# Altium schematic sheet Sheet1.SchDoc
size 317 x 241 mm; SheetNumber: 1; SheetTotal: 1
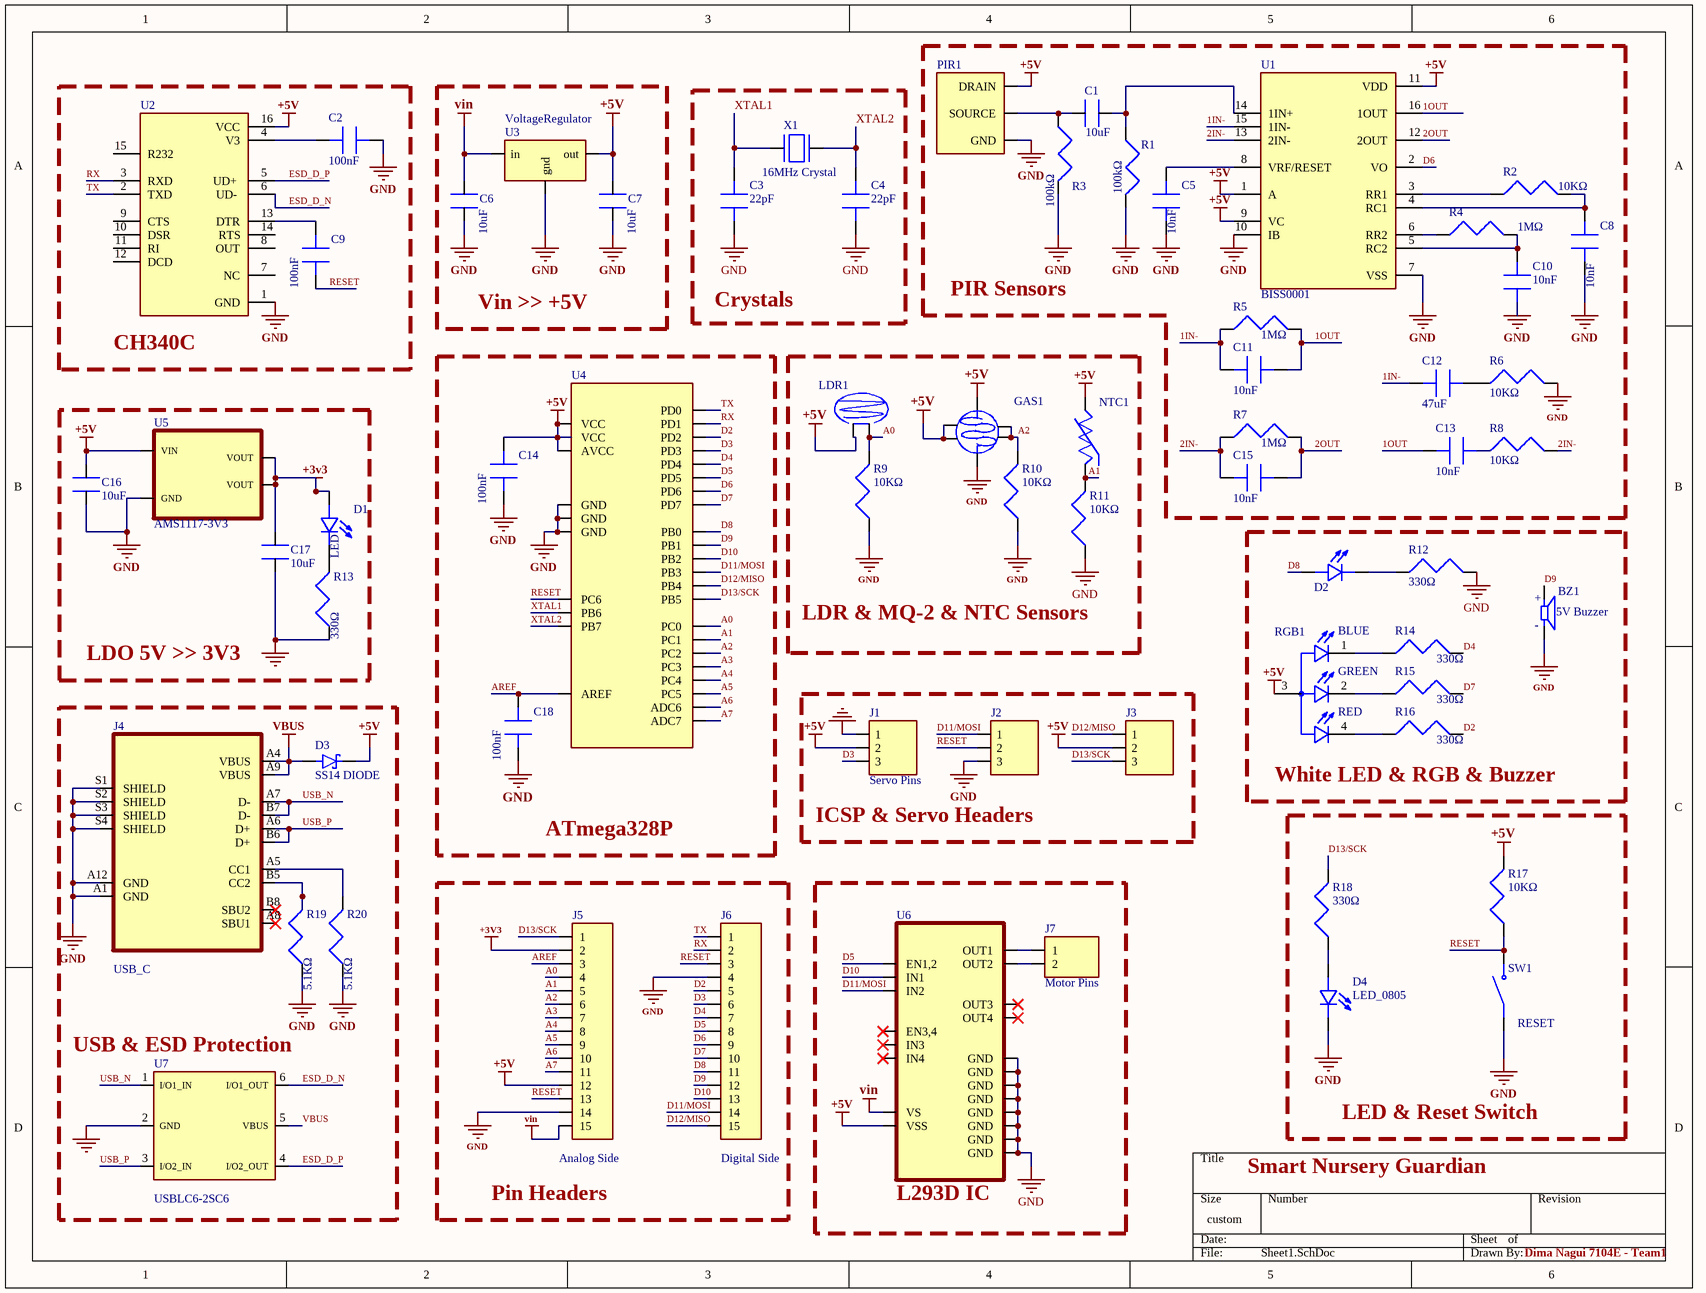
[diagram p0: Sheet1.SchDoc]

## Parts
BZ1  5V Buzzer  [Buzzer]
C1  10uF  [cap]
C2  100nF  [CAP_0603_100nf]
C3  22pF  [CAP_0402_22PF]
C4  22pF  [CAP_0402_22PF]
C5  10nF  [CAP_0603_100nf]
C6  10uF  [cap]
C7  10uF  [cap]
C8  10nF  [CAP_0603_100nf]
C9  100nF  [CAP_0603_100nf]
C10  10nF  [CAP_0603_100nf]
C11  10nF  [CAP_0603_100nf]
C12  47uF  [CAP_0603_100nf]
C13  10nF  [CAP_0603_100nf]
C14  100nF  [CAP_0603_100nf]
C15  10nF  [CAP_0603_100nf]
C16  10uF  [cap]
C17  10uF  [cap]
C18  100nF  [CAP_0603_100nf]
D1  LED  [LED_0805]
D2  LED_0805  [LED_0805]  (value not drawn)
D3  SS14 DIODE  [SS14 DIODE]
D4  LED_0805  [LED_0805]
GAS1  gas_sensor  [gas_sensor - duplicate]  (value not drawn)
J1  Servo Pins  [PIN_HEADER_1X3]
J2  PIN_HEADER_1X3  [PIN_HEADER_1X3]  (value not drawn)
J3  PIN_HEADER_1X3  [PIN_HEADER_1X3]  (value not drawn)
J4  USB_C  [USB_TYPE_C_16_PINS]
J5  Analog Side  [PIN_HEADER_1X15]
J6  Digital Side  [PIN_HEADER_1X15]
J7  Motor Pins  [PIN_HEADER_1X2]
LDR1  LDR  [LDR]  (value not drawn)
NTC1  NTC  [NTC]  (value not drawn)
PIR1  PIR Sensor  [PIR_MOTION SENSOR]  (value not drawn)
R1  100kΩ  [RESC2013X55N]
R2  10KΩ  [RES_10K_0603]
R3  100kΩ  [RESC2013X55N]
R4  1MΩ  [RESC2013X55N]
R5  1MΩ  [RESC2013X55N]
R6  10KΩ  [RES_10K_0603]
R7  1MΩ  [RESC2013X55N]
R8  10KΩ  [RES_10K_0603]
R9  10KΩ  [RES_10K_0603]
R10  10KΩ  [RES_10K_0603]
R11  10KΩ  [RES_10K_0603]
R12  330Ω  [RESC2013X65N]
R13  330Ω  [RESC2013X65N]
R14  330Ω  [RESC2013X65N]
R15  330Ω  [RESC2013X65N]
R16  330Ω  [RESC2013X65N]
R17  10KΩ  [RES_10K_0603]
R18  330Ω  [RESC2013X65N]
R19  5.1KΩ  [RESC1005X40N]
R20  5.1KΩ  [RESC1005X40N]
RGB1  RGB  [RGB]  (value not drawn)
SW1  RESET  [RESET_SWITCH]
U1  BISS0001  [BISS0001]
U2  CH340C  [CH340C]
U3  VoltageRegulator  [regulator]
U4  ATmega328P  [TQFP80P900X900X120-32N]
U5  AMS1117-3V3  [SOT230P700X180-4N]
U6  L293D IC  [SOIC127P1040X250-20N]
U7  USBLC6-2SC6  [SOT95P280X145-6N]
X1  16MHz Crystal  [16MHz Crystal]

## Blocks framed on the sheet
PIR Sensors: C1 C5 C8 C10-C13 C15 PIR1 R1-R8 U1
Vin >> +5V: C6 C7 U3
Crystals: C3 C4 X1
LDR & MQ-2 & NTC Sensors: GAS1 LDR1 NTC1 R9-R11
LDO 5V >> 3V3: C16 C17 D1 R13 U5
White LED & RGB & Buzzer: BZ1 D2 R12 R14-R16 RGB1
USB & ESD Protection: D3 J4 R19 R20 U7
ICSP & Servo Headers: J1-J3
LED & Reset Switch: D4 R17 R18 SW1
Pin Headers: J5 J6

## Nets
+3V3: C17.1 D1.1(A) J5.2 U5.2(VOUT) U5.4(VOUT)
+5V: C7.1 C14.1 C16.1 D3.P2(C) GAS1.1 GAS1.3 GAS1.5 J1.2 J3.2 J5.12 LDR1.2 NTC1.2 PIR1.1(DRAIN) R17.1 RGB1.3(A) U1.1(A) U1.9(VC) U1.11(VDD) U2.16(VCC) U3.2(out) U4.4(VCC) U4.6(VCC) U4.18(AVCC) U5.3(VIN) U6.20(VSS)
GND: BZ1.N C2.2 C3.2 C4.2 C5.2 C6.2 C7.2 C8.2 C10.2 C14.2 C16.2 C17.2 C18.2 D4.2(C) GAS1.2 J1.1 J2.3 J4.A1(GND) J4.A12(GND) J4.S1(SHIELD) J4.S2(SHIELD) J4.S3(SHIELD) J4.S4(SHIELD) J5.14 J6.4 PIR1.3(GND) R1.1 R3.1 R6.1 R9.2 R10.2 R11.2 R12.1 R13.2 R19.2 R20.2 SW1.1 U1.7(VSS) U1.10(IB) U2.1(GND) U3.3(gnd) U4.3(GND) U4.5(GND) U4.21(GND) U5.1(GND) U6.4(GND) U6.5(GND) U6.6(GND) U6.7(GND) U6.14(GND) U6.15(GND) U6.16(GND) U6.17(GND) U7.2(GND)
VBUS: D3.P1(A) J4.A4(VBUS) J4.A9(VBUS) U7.5(VBUS)
vin: C6.1 J5.15 U3.1(in) U6.10(VS)
1IN-: C11.2 C12.2 R5.2 U1.15(1IN-)
1OUT: C11.1 C13.1 R5.1 U1.16(1OUT)
2IN-: C15.2 R7.2 R8.1 U1.13(2IN-)
2OUT: C15.1 R7.1 U1.12(2OUT)
A0: J5.4 LDR1.1 R9.1 U4.23(PC0)
A1: J5.5 NTC1.1 R11.1 U4.24(PC1)
A2: GAS1.4 GAS1.6 J5.6 R10.1 U4.25(PC2)
A3: J5.7 U4.26(PC3)
A4: J5.8 U4.27(PC4)
A5: J5.9 U4.28(PC5)
A6: J5.10 U4.19(ADC6)
A7: J5.11 U4.22(ADC7)
AREF: C18.1 J5.3 U4.20(AREF)
D2: J6.5 R16.1 U4.32(PD2)
D3: J1.3 J6.6 U4.1(PD3)
D4: J6.7 R14.1 U4.2(PD4)
D5: J6.8 U4.9(PD5) U6.1(EN1,2)
D6: J6.9 U1.2(VO) U4.10(PD6)
D7: J6.10 R15.1 U4.11(PD7)
D8: D2.1(A) J6.11 U4.12(PB0)
D9: BZ1.P J6.12 U4.13(PB1)
D10: J6.13 U4.14(PB2) U6.2(IN1)
D11/MOSI: J2.1 J6.14 U4.15(PB3) U6.9(IN2)
D12/MISO: J3.1 J6.15 U4.16(PB4)
D13/SCK: J3.3 J5.1 R18.1 U4.17(PB5)
ESD_D_N: U2.6(UD-) U7.6(I/O1_OUT)
ESD_D_P: U2.5(UD+) U7.4(I/O2_OUT)
RESET: C9.2 J2.2 J5.13 J6.3 R17.2 SW1.2 U4.29(PC6)
RX: J6.2 U2.3(RXD) U4.31(PD1)
TX: J6.1 U2.2(TXD) U4.30(PD0)
USB_N: J4.A7(D-) J4.B7(D-) U7.1(I/O1_IN)
USB_P: J4.A6(D+) J4.B6(D+) U7.3(I/O2_IN)
XTAL1: C3.1 U4.7(PB6) X1.1
XTAL2: C4.1 U4.8(PB7) X1.2
NetC1_1: C1.1 R1.2 U1.14(1IN+)
NetC1_2: C1.2 PIR1.2(SOURCE) R3.2
NetC2_1: C2.1 U2.4(V3)
NetC5_1: C5.1 U1.8(VRF/RESET)
NetC8_1: C8.1 R2.1 U1.4(RC1)
NetC9_1: C9.1 U2.13(DTR)
NetC10_1: C10.1 R4.1 U1.5(RC2)
NetC12_1: C12.1 R6.2
NetC13_2: C13.2 R8.2
NetD1_2: D1.2(C) R13.1
NetD2_2: D2.2(C) R12.2
NetD4_1: D4.1(A) R18.2
NetJ4_A5: J4.A5(CC1) R20.1
NetJ4_B5: J4.B5(CC2) R19.1
NetJ7_1: J7.1 U6.3(OUT1)
NetJ7_2: J7.2 U6.8(OUT2)
NetR2_2: R2.2 U1.3(RR1)
NetR4_2: R4.2 U1.6(RR2)
NetR14_2: R14.2 RGB1.1(B_C)
NetR15_2: R15.2 RGB1.2(G_C)
NetR16_2: R16.2 RGB1.4(R_C)

Not connected (* = marked no-connect by the designer): J4 A8(SBU1)* B8(SBU2)*; U2 7(NC) 8(OUT) 9(CTS) 10(DSR) 11(RI) 12(DCD) 14(RTS) 15(R232); U6 11(EN3,4)* 12(IN3)* 13(OUT3)* 18(OUT4)* 19(IN4)*

## Notes on the sheet
- Smart Nursery Guardian
- Dima Nagui 7104E - Team1
- (in symbol 5V Buzzer) +; -
- (in symbol RGB) BLUE; GREEN; RED

## Library data of the parts
BZ1 = 5V Buzzer: Electro-Magnetic Buzzer (SMD Type); MFR: Huaneng; ComponentLink1Description: New link; ComponentLink1URL: https://www.lcsc.com/product-detail/C94599.html; MFR part #: MLT-8530; supplier: LCSC; supplier part #: C94599; ComponentLink2Description: Datasheet; ComponentLink2URL: https://www.lcsc.com/datasheet/C94599.pdf?spm=wm.sxq.inf.ggs&lcsc_vid=EVULUAZXQgMNAwVTEQcNAVxTFlNbX1YFFVgNBV1RQ1kxVlNeTlFaV1ReR1hfUjsOAxUeFF5JWAYLCg0IHk8JCAsBGwRABAsLWA%3D%3D
C1 C6 C7 C16 C17 = 10uF: CAP CER 10uF 25V X5R 0805; MFR: Taiyo Yuden; MFR part #: TMK212BBJ106KG-T; supplier: lcsc; supplier part #: C386085; ComponentLink1Description: New link; ComponentLink1URL: https://www.lcsc.com/product-detail/C386085.html?s_z=n_q_t_capacitor%25200805%2520&spm=wm.fly.bg.0.xh___wm.ssy.tc.0.tz&lcsc_vid=RQUMVgBfFQNaX1cDEQBcUQJeElRWU1MCTwJYVlNRQlExVlNeTlBaUldRQ1hZXzsOAxUeFF5JWBYZEEoKFBINSQcJGk4dAgUUFAk%3D; ComponentLink2Description: datasheet; ComponentLink2URL: https://www.lcsc.com/datasheet/C386085.pdf?spm=wm.sxq.inf.ggs___wm.fly.bg.0.xh&lcsc_vid=RQUMVgBfFQNaX1cDEQBcUQJeElRWU1MCTwJYVlNRQlExVlNeTlBaUldRQ1hZXzsOAxUeFF5JWBYZEEoKFBINSQcJGk4dAgUUFAk%3D
C2 C9 C14 C18 = 100nF: CAP CER 100nF 50V X7R 0603; MFR: Samsung Electro-Mechanics; MFR part #: CL10B104KB8NNNC; supplier: LCSC; ComponentLink1Description: New link; ComponentLink1URL: https://www.lcsc.com/product-detail/C1591.html?s_z=n_q_p_cap%2520100n%2520&spm=wm.ssy.bg.0.xh&lcsc_vid=EgReBFUDQwddVldUQgMNAlFTFlRdVlRRRAUNAVZRRlIxVlNeQFRWUFBTQ1lcVjsOAxUeFF5JWBYZEEoKFBINSQcJGk4NBhADEA4cHktQQlBADxALGw%3D%3D; supplier part #: C1591; ComponentLink2Description: data sheet; ComponentLink2URL: https://www.lcsc.com/datasheet/C1591.pdf?spm=wm.sxq.inf.ggs___wm.ssy.bg.0.xh&lcsc_vid=EgReBFUDQwddVldUQgMNAlFTFlRdVlRRRAUNAVZRRlIxVlNeQFRWUFBTQ1lcVjsOAxUeFF5JWBYZEEoKFBINSQcJGk4NBhADEA4cHktQQlBADxALGw%3D%3D
C3 C4 = 22pF: CAP CER 22pF 50V NP0 0402; MFR: YAGEO; MFR part #: CC0402JRNPO9BN220; ComponentLink1Description: New link; ComponentLink1URL: https://www.lcsc.com/product-detail/C106203.html?s_z=n_q_t_22pf&spm=wm.fly.bg.4.xh___wm.ssy.tc.0.tz&lcsc_vid=EVULUAZXQgMNAwVTEQcNAVxTFlNbX1YFFVgNBV1RQ1kxVlNeT1lcV1RUTlRbVzsOAxUeFF5JWBYZEEoKFBINSQcJGk4eFQsCAgIaSgADAwAHC0slRlNYUFJIHxUDCw%3D%3D; supplier: LCSC; supplier part #: C106203; ComponentLink2Description: datasheet; ComponentLink2URL: https://www.lcsc.com/datasheet/C106203.pdf?spm=wm.sxq.inf.ggs___wm.fly.bg.4.xh&lcsc_vid=EVULUAZXQgMNAwVTEQcNAVxTFlNbX1YFFVgNBV1RQ1kxVlNeT1lcV1RUTlRbVzsOAxUeFF5JWBYZEEoKFBINSQcJGk4eFQsCAgIaSgADAwAHC0slRlNYUFJIHxUDCw%3D%3D
C5 C8 C10 C11 C13 C15 = 10nF: CAP CER 10nF 50V X7R 0603; MFR: YAGEO; MFR part #: CC0603KRX7R9BB103; supplier: LCSC; ComponentLink1Description: New link; ComponentLink1URL: https://www.lcsc.com/product-detail/C100042.html?s_z=n_q_t_10NF&spm=wm.fly.bg.1.xh___wm.ssy.tc.0.tz&lcsc_vid=EVULUAZXQgMNAwVTEQcNAVxTFlNbX1YFFVgNBV1RQ1kxVlNeTlBbXl1QRlNbUzsOAxUeFF5JWBYZEEoKFBINSQcJGk4eFQsCAgIaSgADAwAHC0slRVhdVFZeR08GEwkK; supplier part #: C100042; ComponentLink2Description: data sheet; ComponentLink2URL: https://www.lcsc.com/datasheet/C100042.pdf?spm=wm.sxq.inf.ggs___wm.fly.bg.1.xh&lcsc_vid=EVULUAZXQgMNAwVTEQcNAVxTFlNbX1YFFVgNBV1RQ1kxVlNeTlBbXl1QRlNbUzsOAxUeFF5JWBYZEEoKFBINSQcJGk4eFQsCAgIaSgADAwAHC0slRVhdVFZeR08GEwkK
C12 = 47uF: CAP CER 47uF 6.3V X5R 0603; MFR: muRata; MFR part #: GRM188R60J476ME15D; supplier: LCSC; ComponentLink1Description: New link; ComponentLink1URL: https://www.lcsc.com/product-detail/C140782.html?s_z=n_q_t_47UF&spm=wm.fly.bg.10.xh___wm.ssy.tc.2.tz&lcsc_vid=EVULUAZXQgMNAwVTEQcNAVxTFlNbX1YFFVgNBV1RQ1kxVlNeTlNfUVJXQ1JfVzsOAxUeFF5JWBYZEEoKFBINSQcJGk4%3D; supplier part #: C140782; ComponentLink2Description: data sheet; ComponentLink2URL: https://www.lcsc.com/datasheet/C140782.pdf?spm=wm.sxq.inf.ggs___wm.fly.bg.10.xh&lcsc_vid=EVULUAZXQgMNAwVTEQcNAVxTFlNbX1YFFVgNBV1RQ1kxVlNeTlNfUVJXQ1JfVzsOAxUeFF5JWBYZEEoKFBINSQcJGk4%3D
D1 D2 D4 = LED_0805: LED RED 0805 SMD; MFR: YONGYUTAI; MFR part #: YLED0805R; supplier: LCSC; supplier part #: C19171391; ComponentLink1Description: New link; ComponentLink1URL: https://www.lcsc.com/product-detail/C19171391.html?s_z=n_q_t_0805%2520LED&spm=wm.fly.bg.0.xh___wm.ssy.tc.0.tz&lcsc_vid=T1QNA1xeQFcIAlReRFQMVgBVFlhZUV1RE1VaUQcHQgQxVlNeQVZfVlRRQFZdUTsOAxUeFF5JWBYZEEoKFBINSQcJGk4NBhADEA4cHktSRlNADxALGw%3D%3D; ComponentLink2Description: data sheet; ComponentLink2URL: https://www.lcsc.com/datasheet/C19171391.pdf?spm=wm.sxq.inf.ggs___wm.fly.bg.0.xh&lcsc_vid=T1QNA1xeQFcIAlReRFQMVgBVFlhZUV1RE1VaUQcHQgQxVlNeQVZfVlRRQFZdUTsOAxUeFF5JWBYZEEoKFBINSQcJGk4NBhADEA4cHktSRlNADxALGw%3D%3D
D3 = SS14 DIODE: DIODE SCHOTTKY 40V SMA(DO-214AC); MFR: MDD(Microdiode Semiconductor); MFR part #: SS14; supplier: lcsc; ComponentLink1Description: New link; ComponentLink1URL: https://www.lcsc.com/product-detail/C2480.html?s_z=n_q_x_SS14&spm=wm.ssy.em.0.tz&lcsc_vid=EVULUAZXQgMNAwVTEQcNAVxTFlNbX1YFFVgNBV1RQ1kxVlNeTlBYV1VVQ1NWXzsOAxUeFF5JWBYZEEoKFBINSQcJGk4NBhADEA4cHktXRlhXSQwSGg0%3D; supplier part #: C2480; ComponentLink2Description: datasheet; ComponentLink2URL: https://www.lcsc.com/datasheet/C2480.pdf?spm=wm.sxq.inf.ggs___wm.ssy.em.0.tz&lcsc_vid=EVULUAZXQgMNAwVTEQcNAVxTFlNbX1YFFVgNBV1RQ1kxVlNeTlBYV1VVQ1NWXzsOAxUeFF5JWBYZEEoKFBINSQcJGk4NBhADEA4cHktXRlhXSQwSGg0%3D
GAS1 = gas_sensor: 300ppm~10000ppm Through Hole Gas Sensors; MFR: Zhengzhou Winsen Elec Tech; MFR part #: MQ-2; supplier: lcsc; supplier part #: C99296; ComponentLink1Description: New link; ComponentLink1URL: https://www.lcsc.com/product-detail/C99296.html?s_z=n_q_C99296&globalKeyword=C99296; ComponentLink2Description: datasheet; ComponentLink2URL: https://www.lcsc.com/datasheet/C99296.pdf?spm=wm.sxq.inf.ggs&lcsc_vid=RQUMVgBfFQNaX1cDEQBcUQJeElRWU1MCTwJYVlNRQlExVlNeTlBdXlZQQllaVDsOAxUeFF5JWBYZEEoKFBINSQcJGk4NBhADEA4cHkteQlRADxALGw%3D%3D
J1-J3 = PIN_HEADER_1X3: 1kV 1 2.54mm Pin Header 3A 2.5mm Through Hole 6mm 3P -40℃~+105℃ 3mm Gold 1x3P Through Hole,P=2.54mm Headers, Male Pins; MFR: hanxia; MFR part #: HX PH254-01-03-Z-L11.5 pcb pin header; supplier: lcsc; supplier part #: C52016391; ComponentLink1Description: data sheet; ComponentLink1URL: https://www.lcsc.com/datasheet/C52016391.pdf?spm=wm.sxq.inf.ggs___wm.ssy.bg.1.xh&lcsc_vid=EgReBFUDQwddVldUQgMNAlFTFlRdVlRRRAUNAVZRRlIxVlNeQFRZXlFSR1dZVDsOAxUeFF5JWBYZEEoKFBINSQcJGk4NBhADEA4cHktfQVVADxALGw%3D%3D; ComponentLink2Description: New link 1; ComponentLink2URL: https://www.lcsc.com/product-detail/C52016391.html?s_z=n_q_p_Pin%2520Header%25202.54mm%25201x3&spm=wm.ssy.bg.1.xh&lcsc_vid=EgReBFUDQwddVldUQgMNAlFTFlRdVlRRRAUNAVZRRlIxVlNeQFRZXlFSR1dZVDsOAxUeFF5JWBYZEEoKFBINSQcJGk4NBhADEA4cHktfQVVADxALGw%3D%3D
J4 = USB_C: CONN RCPT Type-C 16POS SMD; MFR: Korean Hroparts Elec; MFR part #: TYPE-C-31-M-12; supplier: lcsc; supplier part #: C165948; ComponentLink1Description: New link; ComponentLink1URL: https://www.lcsc.com/product-detail/C165948.html?s_z=n_q_p_USB%2520TYPE%2520C&spm=wm.ssy.bg.1.xh&lcsc_vid=T1QNA1xeQFcIAlReRFQMVgBVFlhZUV1RE1VaUQcHQgQxVlNeQFVdUF1RQFBZVDsOAxUeFF5JWBYZEEoKFBINSQcJGk4eFQsCAgIaSgADAwAHC0slT1ZdU0oOAwwC; ComponentLink2Description: data sheet; ComponentLink2URL: https://www.lcsc.com/datasheet/C165948.pdf?spm=wm.sxq.inf.ggs___wm.ssy.bg.1.xh&lcsc_vid=T1QNA1xeQFcIAlReRFQMVgBVFlhZUV1RE1VaUQcHQgQxVlNeQFVdUF1RQFBZVDsOAxUeFF5JWBYZEEoKFBINSQcJGk4eFQsCAgIaSgADAwAHC0slT1ZdU0oOAwwC
J5 J6 = PIN_HEADER_1X15: CONN HEADER 15POS 2.54mm SINGLE ROW TH; MFR: Megastar; MFR part #: ZX-PZ2.54-1-15PZZ; supplier: lcsc; supplier part #: C7501269; ComponentLink1Description: data sheet; ComponentLink1URL: https://www.lcsc.com/datasheet/C7501269.pdf?spm=wm.sxq.inf.ggs___wm.fly.bg.1.xh&lcsc_vid=EVULUAZXQgMNAwVTEQcNAVxTFlNbX1YFFVgNBV1RQ1kxVlNeTlNeUVFUT1ddXzsOAxUeFF5JWBYZEEoKFBINSQcJGk4eFQsCAgIaSgADAwAHC0slQ1BaVVNWQVlADxALGw%3D%3D; ComponentLink2Description: New link 1; ComponentLink2URL: https://www.lcsc.com/product-detail/C7501269.html?s_z=n_q_t_15P%2520HEADER&spm=wm.fly.bg.1.xh___wm.ssy.tc.0.tz&lcsc_vid=EVULUAZXQgMNAwVTEQcNAVxTFlNbX1YFFVgNBV1RQ1kxVlNeTlNeUVFUT1ddXzsOAxUeFF5JWBYZEEoKFBINSQcJGk4eFQsCAgIaSgADAwAHC0slQ1BaVVNWQVlADxALGw%3D%3D
J7 = PIN_HEADER_1X2: CONN HEADER 2POS 2.54mm SINGLE ROW TH; MFR: hanxia; MFR part #: HX PZ2.54-1x2P ZZ; supplier: lcsc; supplier part #: C32713268; ComponentLink1Description: data sheet; ComponentLink1URL: https://www.lcsc.com/product-detail/C32713268.html?s_z=n_q_t_pin%2520header&spm=wm.fly.bg.3.stp___wm.ssy.tc.0.tz&lcsc_vid=EVULUAZXQgMNAwVTEQcNAVxTFlNbX1YFFVgNBV1RQ1kxVlNeTlBYVVZfRlJcUjsOAxUeFF5JWBYZEEoKFBINSQcJGk4eFQsCAgIaSgADAwAHC0slRVZdUVVXWQkaCgg%3D; ComponentLink2Description: New link 1; ComponentLink2URL: https://www.lcsc.com/datasheet/C32713268.pdf?spm=wm.sxq.inf.ggs___wm.fly.bg.3.stp&lcsc_vid=EVULUAZXQgMNAwVTEQcNAVxTFlNbX1YFFVgNBV1RQ1kxVlNeTlBYVVZfRlJcUjsOAxUeFF5JWBYZEEoKFBINSQcJGk4eFQsCAgIaSgADAwAHC0slRVZdUVVXWQkaCgg%3D
LDR1 = LDR: 540nm 50kΩ~100kΩ 5MΩ Through Hole Photoresistors; MFR: NTE Electronics; MFR part #: 02-LDR1; supplier: lcsc; supplier part #: C17682488; ComponentLink1Description: New link; ComponentLink1URL: https://www.lcsc.com/product-detail/C17682488.html?s_z=n_q_LDR%2520C17682488&spm=wm.fly.bg.0.xh&lcsc_vid=RQUMVgBfFQNaX1cDEQBcUQJeElRWU1MCTwJYVlNRQlExVlNeTlBcV1NeRVBbXzsOAxUeFF5JWBYZEEoKFBINSQcJGk4NBhADEA4cHktSRlNADxALGw%3D%3D; ComponentLink2Description: datasheet; ComponentLink2URL: https://www.lcsc.com/datasheet/C17682488.pdf?spm=wm.sxq.inf.ggs___wm.fly.bg.0.xh&lcsc_vid=RQUMVgBfFQNaX1cDEQBcUQJeElRWU1MCTwJYVlNRQlExVlNeTlBcV1NeRVBbXzsOAxUeFF5JWBYZEEoKFBINSQcJGk4NBhADEA4cHktSRlNADxALGw%3D%3D
NTC1 = NTC: THERMISTOR NTC 10kΩ 3380K 0402; MFR: TDK; MFR part #: NTCG103JF103FT1; supplier: lcsc; supplier part #: C209959; ComponentLink1Description: New link; ComponentLink1URL: https://www.lcsc.com/product-detail/C209959.html?s_z=n_q_NTCG103JF103FT1&spm=wm.fly.bg.0.xh&lcsc_vid=EVULUAZXQgMNAwVTEQcNAVxTFlNbX1YFFVgNBV1RQ1kxVlNeTlNfX1xWQVBbUjsOAxUeFF5JWBYZEEoKFBINSQcJGk4NBhADEA4cHktXRVZcSQwSGg0%3D; ComponentLink2Description: DATASHEET; ComponentLink2URL: https://www.lcsc.com/datasheet/C209959.pdf?spm=wm.sxq.inf.ggs___wm.fly.bg.0.xh&lcsc_vid=EVULUAZXQgMNAwVTEQcNAVxTFlNbX1YFFVgNBV1RQ1kxVlNeTlNfX1xWQVBbUjsOAxUeFF5JWBYZEEoKFBINSQcJGk4NBhADEA4cHktXRVZcSQwSGg0%3D
PIR1 = PIR Sensor: Pyroelectric infrared sensor; MFR: Senba Sensing Tech; MFR part #: D203S; supplier: lcsc; supplier part #: C78793; ComponentLink1Description: New link; ComponentLink1URL: https://www.lcsc.com/product-detail/C78793.html?s_z=n_q_C78793&globalKeyword=C78793; ComponentLink2Description: datasheet; ComponentLink2URL: https://www.lcsc.com/datasheet/C78793.pdf?spm=wm.sxq.inf.ggs&lcsc_vid=EVULUAZXQgMNAwVTEQcNAVxTFlNbX1YFFVgNBV1RQ1kxVlNeTlBaUlBVRVhWUjsOAxUeFF5JWBYZEEoKFBINSQcJGk4dAgUUFAk%3D
R1 R3 = 100kΩ: RES 100kΩ ±1% 125mW 0805; MFR: UNI-ROYAL; MFR part #: 0805W8F1003T5E; supplier: lcsc; supplier part #: C149504; ComponentLink1Description: New link; ComponentLink1URL: https://www.lcsc.com/product-detail/C149504.html?s_z=n_q_t_100%2520k%25CE%25A9%2520resistor%25200805&spm=wm.fly.bg.0.xh___wm.ssy.tc.0.tz&lcsc_vid=RQUMVgBfFQNaX1cDEQBcUQJeElRWU1MCTwJYVlNRQlExVlNeTlBcV1xUQVlbUjsOAxUeFF5JWBYZEEoKFBINSQcJGk4NBhADEA4cHktXRlhXSQwSGg0%3D; ComponentLink2Description: datasheet; ComponentLink2URL: https://www.lcsc.com/datasheet/C149504.pdf?spm=wm.sxq.inf.ggs___wm.fly.bg.0.xh&lcsc_vid=RQUMVgBfFQNaX1cDEQBcUQJeElRWU1MCTwJYVlNRQlExVlNeTlBcV1xUQVlbUjsOAxUeFF5JWBYZEEoKFBINSQcJGk4NBhADEA4cHktXRlhXSQwSGg0%3D
R2 R6 R8-R11 R17 = 10KΩ: RES 10kΩ ±1% 100mW 0603; MFR: YAGEO; MFR part #: RC0603FR-0710KL; Supplier: LCSC; ComponentLink1Description: New link; ComponentLink1URL: https://www.lcsc.com/product-detail/C98220.html?s_z=n_q_p_RES%252010K%2520OHM&spm=wm.ssy.bg.0.xh&lcsc_vid=EgReBFUDQwddVldUQgMNAlFTFlRdVlRRRAUNAVZRRlIxVlNeQFRZX11XRFNaVTsOAxUeFF5JWBYZEEoKFBINSQcJGk4NBhADEA4cHktXRlhXSQwSGg0%3D; Supplier part #: C98220; ComponentLink2Description: data sheet; ComponentLink2URL: https://www.lcsc.com/datasheet/C98220.pdf?spm=wm.sxq.inf.ggs___wm.ssy.bg.0.xh&lcsc_vid=EgReBFUDQwddVldUQgMNAlFTFlRdVlRRRAUNAVZRRlIxVlNeQFRZX11XRFNaVTsOAxUeFF5JWBYZEEoKFBINSQcJGk4NBhADEA4cHktXRlhXSQwSGg0%3D
R4 R5 R7 = 1MΩ: RES 1MΩ ±1% 125mW 0805; MFR: FOJAN; MFR part #: FRC0805F1004TS; supplier: lcsc; supplier part #: C2933280; ComponentLink1Description: New link; ComponentLink1URL: https://www.lcsc.com/product-detail/C2933280.html?s_z=n_q_t_1000k%2520ohm&spm=wm.fly.bg.3.xh___wm.ssy.tc.0.tz&lcsc_vid=EVULUAZXQgMNAwVTEQcNAVxTFlNbX1YFFVgNBV1RQ1kxVlNeTlBbXlNSQFZeUDsOAxUeFF5JWBYZEEoKFBINSQcJGk4NBhADEA4cHktXRlhXSQwSGg0%3D; ComponentLink2Description: datasheet; ComponentLink2URL: https://www.lcsc.com/datasheet/C2933280.pdf?spm=wm.sxq.inf.ggs___wm.fly.bg.3.xh&lcsc_vid=EVULUAZXQgMNAwVTEQcNAVxTFlNbX1YFFVgNBV1RQ1kxVlNeTlBbXlNSQFZeUDsOAxUeFF5JWBYZEEoKFBINSQcJGk4NBhADEA4cHktXRlhXSQwSGg0%3D
R12-R16 R18 = 330Ω: RES 330Ω ±1% 125mW 0805; MFR: UNI-ROYAL; MFR part #: 0805W8F3300T5E; Supplier: LCSC; ComponentLink1Description: New link; ComponentLink1URL: https://www.lcsc.com/product-detail/C17630.html?s_z=n_q_0805%2520330%2520ohm%2520resistor&spm=wm.fly.bg.0.xh&lcsc_vid=T1QNA1xeQFcIAlReRFQMVgBVFlhZUV1RE1VaUQcHQgQxVlNeQVZeUVVVRlRZVjsOAxUeFF5JWBYZEEoKFBINSQcJGk4NBhADEA4cHktXRlhXSQwSGg0%3D; Supplier part #: C17630; ComponentLink2Description: data sheet; ComponentLink2URL: https://www.lcsc.com/datasheet/C17630.pdf?spm=wm.sxq.inf.ggs___wm.fly.bg.0.xh&lcsc_vid=T1QNA1xeQFcIAlReRFQMVgBVFlhZUV1RE1VaUQcHQgQxVlNeQVZeUVVVRlRZVjsOAxUeFF5JWBYZEEoKFBINSQcJGk4NBhADEA4cHktXRlhXSQwSGg0%3D
R19 R20 = 5.1KΩ: RES 5.1kΩ ±1% 62.5mW 0402; MFR: YAGEO; MFR part #: RC0402FR-075K1L; Supplier: LCSC; ComponentLink1Description: New link; ComponentLink1URL: https://www.lcsc.com/product-detail/C105872.html?s_z=n_q_t_res%25205.1k&spm=wm.fly.bg.0.xh___wm.ssy.tc.0.tz&lcsc_vid=EgReBFUDQwddVldUQgMNAlFTFlRdVlRRRAUNAVZRRlIxVlNeQFRfV1JRR1FdXzsOAxUeFF5JWBYZEEoKFBINSQcJGk4dAgUUFAk%3D; Supplier part #: C105872; ComponentLink2Description: data sheet; ComponentLink2URL: https://www.lcsc.com/datasheet/C105872.pdf?spm=wm.sxq.inf.ggs___wm.fly.bg.0.xh&lcsc_vid=EgReBFUDQwddVldUQgMNAlFTFlRdVlRRRAUNAVZRRlIxVlNeQFRfV1JRR1FdXzsOAxUeFF5JWBYZEEoKFBINSQcJGk4dAgUUFAk%3D
RGB1 = RGB: LED RED, GREEN, BLUE WATER CLEAR SMD; MFR: TOGIALED; MFR part #: TJ-S1608SW6TDSLCCYRGB-A5; upplier: lcsc; ComponentLink1Description: New link; ComponentLink1URL: https://www.lcsc.com/product-detail/C5356078.html?s_z=n_q_C5356078&globalKeyword=C5356078; supplier part #: C5356078; ComponentLink2Description: New link 1; ComponentLink2URL: https://www.lcsc.com/datasheet/C5356078.pdf?spm=wm.sxq.inf.ggs&lcsc_vid=EVULUAZXQgMNAwVTEQcNAVxTFlNbX1YFFVgNBV1RQ1kxVlNeTlBYVVRfTlVdUTsOAxUeFF5JWBYZEEoKFBINSQcJGk4NBhADEA4cHktSRlNADxALGw%3D%3D
SW1 = RESET_SWITCH: SWITCH TACTILE SPST 250gf SMD; MFR: hanxia; MFR part #: HX 3x6x2.5A-2.5N; supplier: lcsc; supplier part #: SMD,6x3mm; ComponentLink1Description: New link; ComponentLink1URL: https://www.lcsc.com/product-detail/C36498960.html?s_z=n_q_t_Tactile%2520switch&spm=wm.fly.bg.18.stp___wm.ssy.tc.0.tz&lcsc_vid=EVULUAZXQgMNAwVTEQcNAVxTFlNbX1YFFVgNBV1RQ1kxVlNeTlBYVFFeQFNXVTsOAxUeFF5JWBYZEEoKFBINSQcJGk4NBhADEA4cHktRTlNADxALGw%3D%3D; ComponentLink2Description: DATASHEET; ComponentLink2URL: https://www.lcsc.com/datasheet/C36498960.pdf?spm=wm.sxq.inf.ggs___wm.fly.bg.18.stp&lcsc_vid=EVULUAZXQgMNAwVTEQcNAVxTFlNbX1YFFVgNBV1RQ1kxVlNeTlBYVFFeQFNXVTsOAxUeFF5JWBYZEEoKFBINSQcJGk4NBhADEA4cHktRTlNADxALGw%3D%3D
U1 = BISS0001: Infrared Sensing Signal Processor; MFR: UMW; MFR part #: BISS0001; supplier: lcsc; supplier part #: C404323; ComponentLink1Description: New link; ComponentLink1URL: https://www.lcsc.com/product-detail/C404323.html?s_z=n_q_t_BISS0001&spm=wm.fly.bg.0.stp___wm.ssy.tc.0.tz&lcsc_vid=EVULUAZXQgMNAwVTEQcNAVxTFlNbX1YFFVgNBV1RQ1kxVlNeTlBaVF1eTlVcVDsOAxUeFF5JWBYZEEoKFBINSQcJGk4eFQsCAgIaSgADAwAHC0slRVlWUF1WRk8GEwkK; ComponentLink2Description: datasheet; ComponentLink2URL: https://www.lcsc.com/datasheet/C404323.pdf?spm=wm.sxq.inf.ggs___wm.fly.bg.0.stp&lcsc_vid=EVULUAZXQgMNAwVTEQcNAVxTFlNbX1YFFVgNBV1RQ1kxVlNeTlBaVF1eTlVcVDsOAxUeFF5JWBYZEEoKFBINSQcJGk4eFQsCAgIaSgADAwAHC0slRVlWUF1WRk8GEwkK
U2 = CH340C: USB to Serial Port chip; MFR: WCH; MFR part #: CH340C; supplier: lcsc; supplier part #: C84681; ComponentLink1Description: New link; ComponentLink1URL: https://www.lcsc.com/product-detail/C84681.html?s_z=n_q_CH340C&spm=wm.fly.bg.0.stp&lcsc_vid=EVULUAZXQgMNAwVTEQcNAVxTFlNbX1YFFVgNBV1RQ1kxVlNeTlBbUVxWRFJfUTsOAxUeFF5JWBYZEEoKFBINSQcJGk4%3D; ComponentLink2Description: DATASHEET; ComponentLink2URL: https://www.lcsc.com/datasheet/C84681.pdf?spm=wm.sxq.inf.ggs___wm.fly.bg.0.stp&lcsc_vid=EVULUAZXQgMNAwVTEQcNAVxTFlNbX1YFFVgNBV1RQ1kxVlNeTlBbUVxWRFJfUTsOAxUeFF5JWBYZEEoKFBINSQcJGk4%3D
U3 = VoltageRegulator: TO-220 plastic-packaged voltage regulator; MFR: BLUE ROCKET; MFR part #: 7805A; supplier: lcsc; supplier part #: C7429876; ComponentLink1Description: New link; ComponentLink1URL: https://www.lcsc.com/product-detail/C7429876.html?s_z=n_q_C7429876&globalKeyword=C7429876; ComponentLink2Description: datasheet; ComponentLink2URL: https://www.lcsc.com/datasheet/C7429876.pdf?spm=wm.sxq.inf.ggs&lcsc_vid=RQUMVgBfFQNaX1cDEQBcUQJeElRWU1MCTwJYVlNRQlExVlNeTlBaVlFQQlZfUzsOAxUeFF5JWBYZEEoKFBINSQcJGk4eFQsCAgIaSgADAwAHC0slRVlaX1ZSRk8GEwkK
U4 = ATmega328P: 8-bit Microcontroller with In-System Programmable Flash; MFR: MICROCHIP; MFR part #: ATMEGA328P-AU; supplier: lcsc; supplier part #: C14877; ComponentLink1Description: New link; ComponentLink1URL: https://www.lcsc.com/product-detail/C14877.html?s_z=n_q_t_atmega328p%2520TQFP&spm=wm.fly.bg.0.xh___wm.ssy.tc.0.tz&lcsc_vid=EVULUAZXQgMNAwVTEQcNAVxTFlNbX1YFFVgNBV1RQ1kxVlNeT1ZdUlRQQ1JWUjsOAxUeFF5JWBYZEEoKFBINSQcJGk4NBhADEA4cHktfQ1BADxALGw%3D%3D; ComponentLink2Description: datasheet; ComponentLink2URL: https://www.lcsc.com/datasheet/C14877.pdf?spm=wm.sxq.inf.ggs___wm.fly.bg.0.xh&lcsc_vid=EVULUAZXQgMNAwVTEQcNAVxTFlNbX1YFFVgNBV1RQ1kxVlNeT1ZdUlRQQ1JWUjsOAxUeFF5JWBYZEEoKFBINSQcJGk4NBhADEA4cHktfQ1BADxALGw%3D%3D
U5 = AMS1117-3V3: 1A Low Dropout (LDO) Regulator; MFR: Advanced Monolithic Systems; MFR part #: AMS1117-3.3; supplier: lcsc; supplier part #: C6186; ComponentLink1Description: New link; ComponentLink1URL: https://www.lcsc.com/product-detail/C6186.html?s_z=n_q_am1117&spm=wm.fly.bg.0.stp&lcsc_vid=T1QNA1xeQFcIAlReRFQMVgBVFlhZUV1RE1VaUQcHQgQxVlNeQVZeVVJeRlVbXzsOAxUeFF5JWBYZEEoKFBINSQcJGk4NBhADEA4cHktXRlVcSQwSGg0%3D; ComponentLink2Description: data sheet; ComponentLink2URL: https://www.lcsc.com/datasheet/C6186.pdf?spm=wm.sxq.inf.ggs___wm.fly.bg.0.stp&lcsc_vid=T1QNA1xeQFcIAlReRFQMVgBVFlhZUV1RE1VaUQcHQgQxVlNeQVZeVVJeRlVbXzsOAxUeFF5JWBYZEEoKFBINSQcJGk4NBhADEA4cHktXRlVcSQwSGg0%3D
U6 = L293D IC: PUSH-PULL FOUR CHANNEL DRIVER WITH DIODES; MFR: HGSEMI; MFR part #: L293DDM/TR; supplier: lcsc; supplier part #: C2973803; ComponentLink1Description: New link; ComponentLink1URL: https://www.lcsc.com/product-detail/C2973803.html?s_z=n_q_t_L293D&spm=wm.fly.bg.1.xh___wm.ssy.tc.0.tz&lcsc_vid=EVULUAZXQgMNAwVTEQcNAVxTFlNbX1YFFVgNBV1RQ1kxVlNeT1lfUVRfQFVXUDsOAxUeFF5JWBYZEEoKFBINSQcJGk4NBhADEA4cHktfQ1BADxALGw%3D%3D; ComponentLink2Description: Datasheet; ComponentLink2URL: https://www.lcsc.com/datasheet/C2973803.pdf?spm=wm.sxq.inf.ggs___wm.fly.bg.1.xh&lcsc_vid=EVULUAZXQgMNAwVTEQcNAVxTFlNbX1YFFVgNBV1RQ1kxVlNeT1lfUVRfQFVXUDsOAxUeFF5JWBYZEEoKFBINSQcJGk4NBhADEA4cHktfQ1BADxALGw%3D%3D
U7 = USBLC6-2SC6: ESD DIODE 5.25VWM 17VC SOT-23-6L; MFR: ST; MFR part #: USBLC6-2SC6; supplier: lcsc; supplier part #: C7519; ComponentLink1Description: datasheet; ComponentLink1URL: https://www.lcsc.com/datasheet/C7519.pdf?spm=wm.sxq.inf.ggs___wm.fly.bg.0.stp&lcsc_vid=EgReBFUDQwddVldUQgMNAlFTFlRdVlRRRAUNAVZRRlIxVlNeQFRcVFFXQ1lbVTsOAxUeFF5JWBYZEEoKFBINSQcJGk4NBhADEA4cHktXRlhXSQwSGg0%3D; ComponentLink2Description: New link 1; ComponentLink2URL: https://www.lcsc.com/product-detail/C7519.html?s_z=n_q_USBLC6-2SC6&spm=wm.fly.bg.0.stp&lcsc_vid=EgReBFUDQwddVldUQgMNAlFTFlRdVlRRRAUNAVZRRlIxVlNeQFRcVFFXQ1lbVTsOAxUeFF5JWBYZEEoKFBINSQcJGk4NBhADEA4cHktXRlhXSQwSGg0%3D
X1 = 16MHz Crystal Oscillator: CRYSTAL 16MHz 20pF SMD; MFR: YXC Crystal Oscillators; MFR part #: X49SM16MSD2SC; supplier: LCSC; supplier part #: C12676; ComponentLink1Description: New link; ComponentLink1URL: https://www.lcsc.com/product-detail/C12676.html; ComponentLink2Description: datasheet; ComponentLink2URL: https://www.lcsc.com/datasheet/C12676.pdf?spm=wm.sxq.inf.ggs&lcsc_vid=EVULUAZXQgMNAwVTEQcNAVxTFlNbX1YFFVgNBV1RQ1kxVlNeT1lfXlBURFlWVzsOAxUeFF5JWAYLCg0IHk8JCAsBGwRABAsLWA%3D%3D